# Altium schematic sheet Sheet2.SchDoc
size A; SheetNumber: 1; SheetTotal: 1
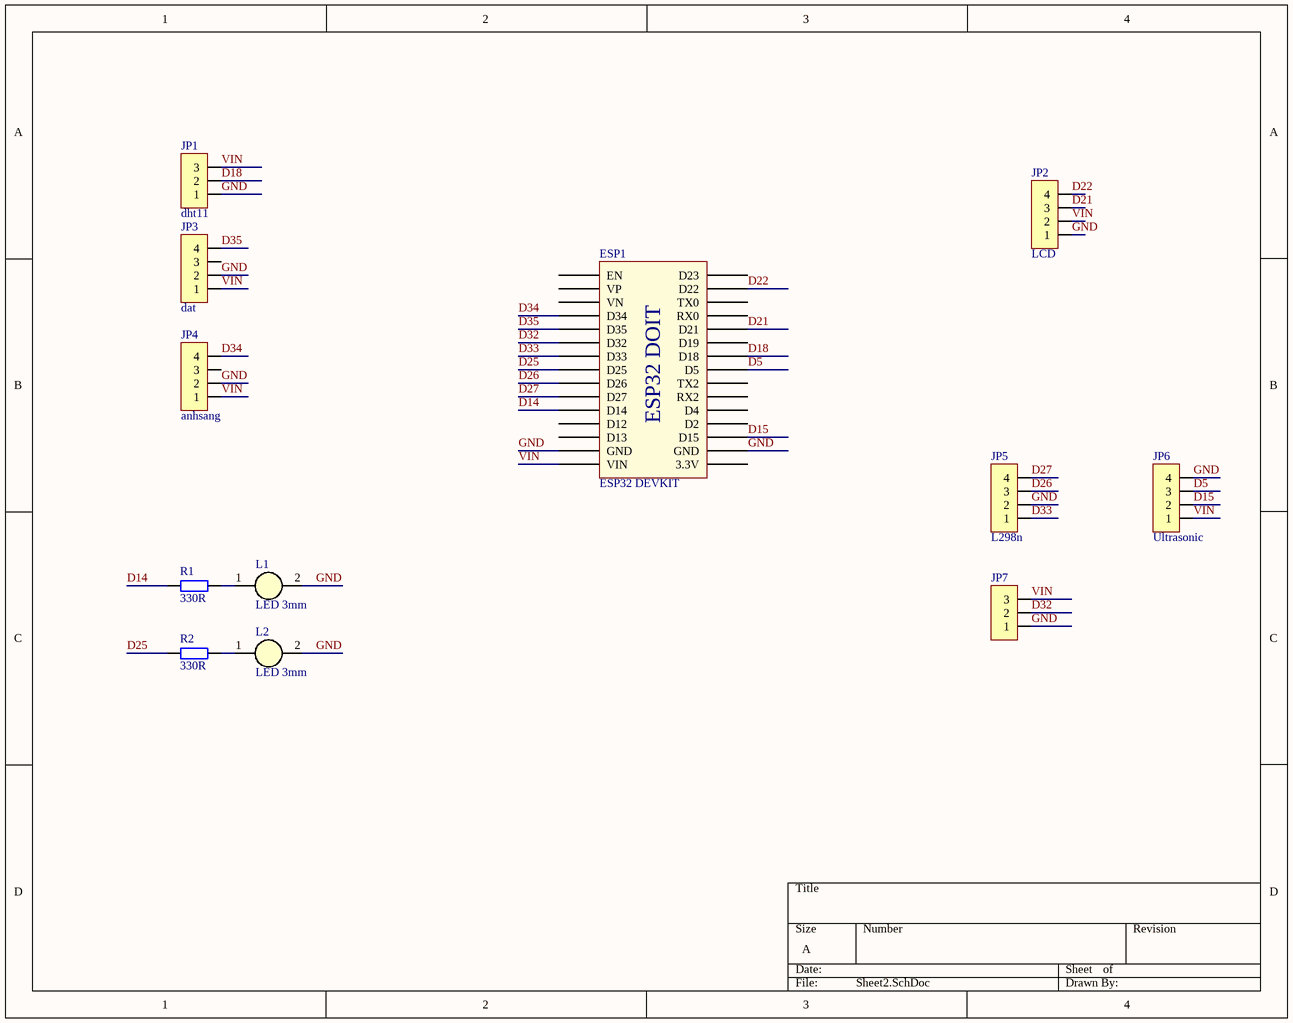
[diagram p0: Sheet2.SchDoc]

## Parts
ESP1  ESP32 DEVKIT  [ESP32 WROOM 32 KIT]
JP1  dht11  [JP 1x3 CT]
JP2  LCD  [JP 1x4 CC]
JP3  dat  [JP 1x4 CT]
JP4  anhsang  [JP 1x4 CT]
JP5  L298n  [JP 1x4 CT]
JP6  Ultrasonic  [JP 1x4 CT]
JP7  (no value)  [JP 1x3 CT]
L1  LED 3mm  [LED-3MM-WHITE]
L2  LED 3mm  [LED-3MM-WHITE]
R1  330R  [tro vach 1/2w]
R2  330R  [tro vach 1/2w]

## Nets
D5: ESP1.23(D5) JP6.3
D14: ESP1.11(D14) R1.1
D15: ESP1.18(D15) JP6.2
D18: ESP1.24(D18) JP1.2
D21: ESP1.26(D21) JP2.3
D22: ESP1.29(D22) JP2.4
D25: ESP1.8(D25) R2.1
D26: ESP1.9(D26) JP5.3
D27: ESP1.10(D27) JP5.4
D32: ESP1.6(D32) JP7.2
D33: ESP1.7(D33) JP5.1
D34: ESP1.4(D34) JP4.4
D35: ESP1.5(D35) JP3.4
GND: ESP1.14(GND) ESP1.17(GND) JP1.1 JP2.1 JP3.2 JP4.2 JP5.2 JP6.4 JP7.1 L1.2(K) L2.2(K)
VIN: ESP1.15(VIN) JP1.3 JP2.2 JP3.1 JP4.1 JP6.1 JP7.3
NetL1_1: L1.1(A) R1.2
NetL2_1: L2.1(A) R2.2

Not connected (* = marked no-connect by the designer): ESP1 1(EN) 2(VP) 3(VN) 12(D12) 13(D13) 16(3.3V) 19(D2) 20(D4) 21(RX2) 22(TX2) 25(D19) 27(RX0) 28(TX0) 30(D23); JP3 3; JP4 3

## Notes on the sheet
- (in symbol ESP32 WROOM 32 KIT) ESP32 DOIT

## Library data of the parts
ESP1 = ESP32 WROOM 32 KIT
JP1 JP7 = JP 1x3 2.54 Cai Thang: Cắm; Ten_Linh_Kien: Jump Đơn Cái 2.54MM 1x20P Thẳng; Don_Vi: Con; Ma_Hang: MH004006; Ghi_Chu: *; Kieu_Chan: *; Chung_Loai: Cắm
JP2 = JP 1x4 2.54 Cai Cong: Cắm; Ten_Linh_Kien: Jump Đơn Cái 2.54MM 1x40P Cong; Don_Vi: Con; Ma_Hang: MH001265; Ghi_Chu: *; Kieu_Chan: *; Chung_Loai: Cắm
JP3-JP6 = JP 1x4 2.54 Cai Thang: Cắm; Ten_Linh_Kien: Jump Đơn Cái 2.54MM 1x20P Thẳng; Don_Vi: Con; Ma_Hang: MH004006; Ghi_Chu: *; Kieu_Chan: *; Chung_Loai: Cắm
L1 L2 = LED 3mm Trang: Cắm; Don_Vi: Con; Ma_Hang: MH009001; Ten_Linh_Kien: LED 3MM Trắng SS (1000c); Ghi_Chu: *; Kieu_Chan: *; Chung_Loai: Cắm
R1 R2 = Tro Vach 1/2W 5% 330R: Cắm; Don_Vi: Con; So_Chan: 2; Ten_Linh_Kien: Trở 5% 1/2w 330R; Ma_Hang: MH006204; Chung_Loai: Cắm; Kieu_Chan: *